# Altium project RELAY 01.PrjPcb
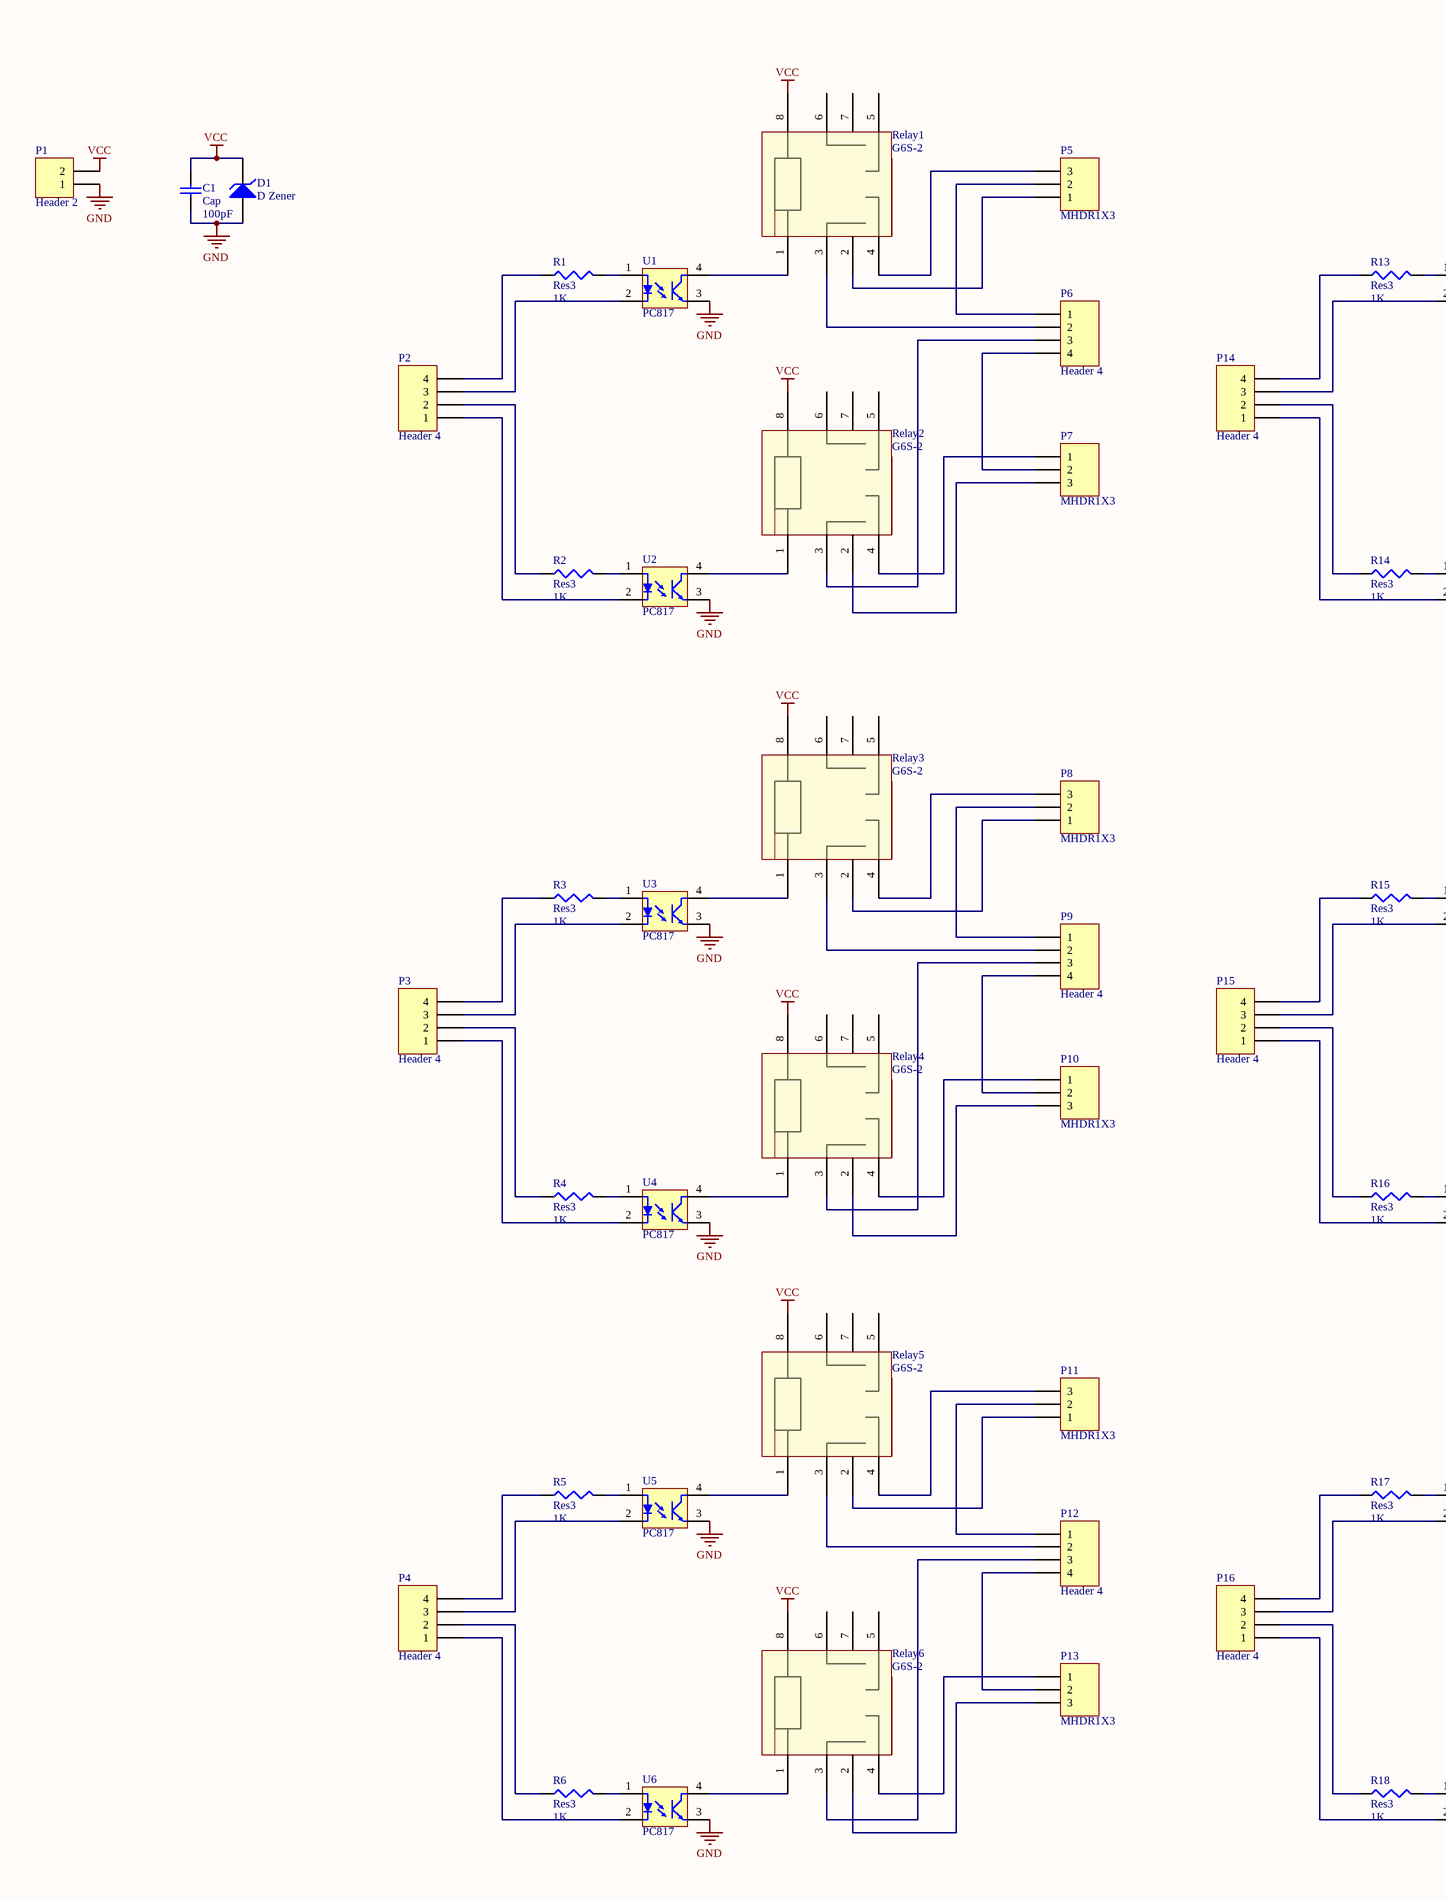
[diagram p0: Relay 01.SchDoc, left]
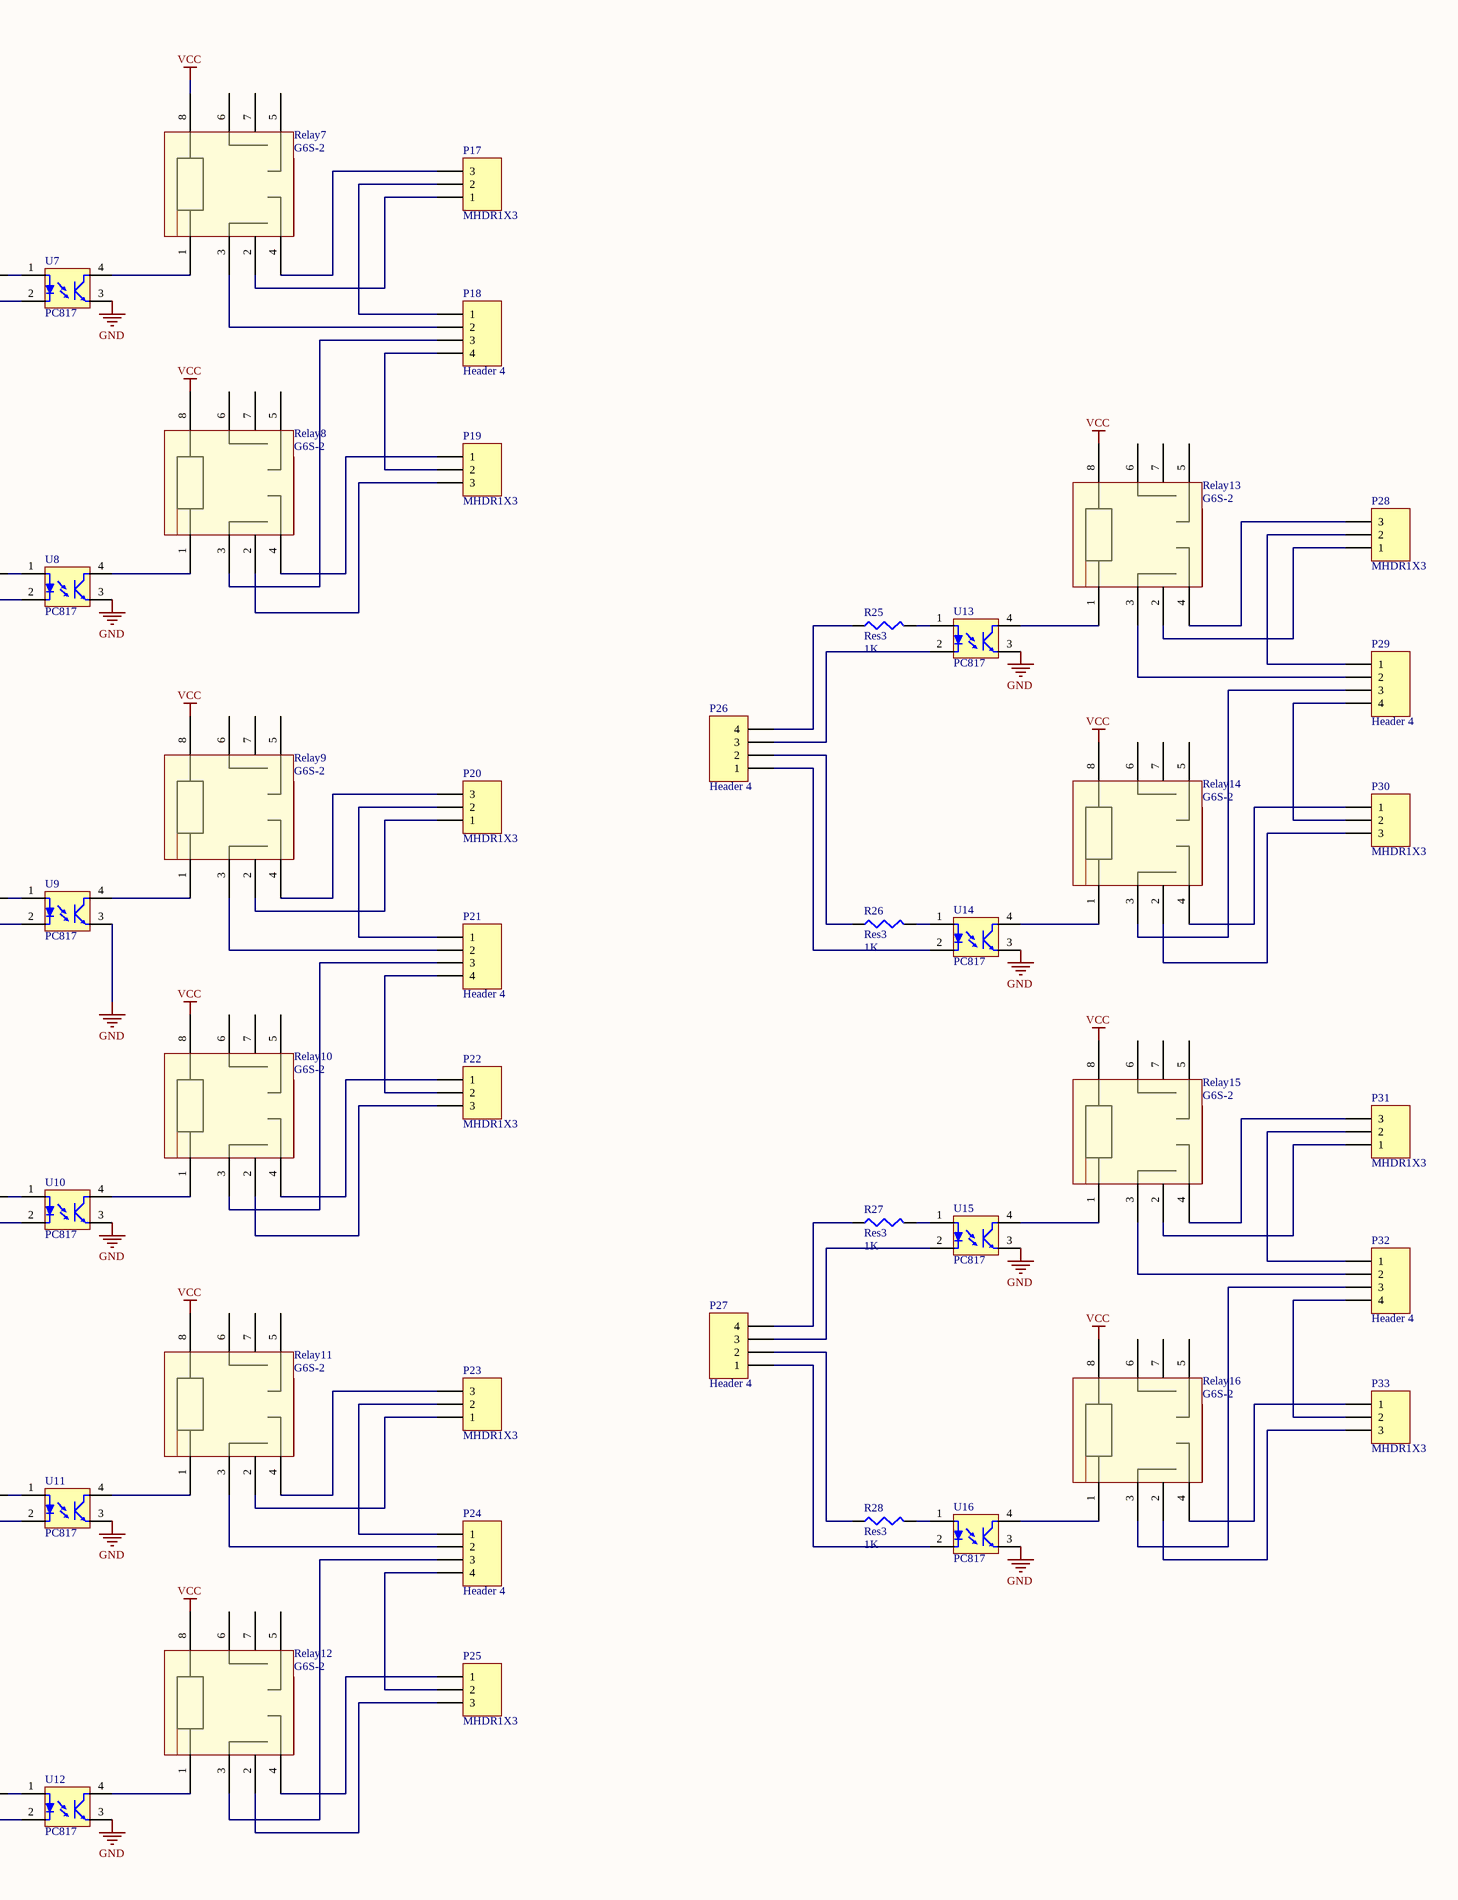
[diagram p1: Relay 01.SchDoc, right]
1 sheet, 83 parts. Net scope: global (net labels, ports and power ports of the same name join across sheets).
Board file: Relay 01.PcbDoc

## Sheet Relay 01.SchDoc
size D

### Parts
C1  Cap  value 100pF  [RAD-0.3]
D1  D Zener  [DIODE-0.7]
P1  Header 2  [CON2]
P2  Header 4  [CON4]
P3  Header 4  [CON4]
P4  Header 4  [CON4]
P5  MHDR1X3  [HDR1X3]
P6  Header 4  [CON4]
P7  MHDR1X3  [HDR1X3]
P8  MHDR1X3  [HDR1X3]
P9  Header 4  [CON4]
P10  MHDR1X3  [HDR1X3]
P11  MHDR1X3  [HDR1X3]
P12  Header 4  [CON4]
P13  MHDR1X3  [HDR1X3]
P14  Header 4  [CON4]
P15  Header 4  [CON4]
P16  Header 4  [CON4]
P17  MHDR1X3  [HDR1X3]
P18  Header 4  [CON4]
P19  MHDR1X3  [HDR1X3]
P20  MHDR1X3  [HDR1X3]
P21  Header 4  [CON4]
P22  MHDR1X3  [HDR1X3]
P23  MHDR1X3  [HDR1X3]
P24  Header 4  [CON4]
P25  MHDR1X3  [HDR1X3]
P26  Header 4  [CON4]
P27  Header 4  [CON4]
P28  MHDR1X3  [HDR1X3]
P29  Header 4  [CON4]
P30  MHDR1X3  [HDR1X3]
P31  MHDR1X3  [HDR1X3]
P32  Header 4  [CON4]
P33  MHDR1X3  [HDR1X3]
R1  Res3  value 1K  [R1/4W]
R2  Res3  value 1K  [R1/4W]
R3  Res3  value 1K  [R1/4W]
R4  Res3  value 1K  [R1/4W]
R5  Res3  value 1K  [R1/4W]
R6  Res3  value 1K  [R1/4W]
R13  Res3  value 1K  [R1/4W]
R14  Res3  value 1K  [R1/4W]
R15  Res3  value 1K  [R1/4W]
R16  Res3  value 1K  [R1/4W]
R17  Res3  value 1K  [R1/4W]
R18  Res3  value 1K  [R1/4W]
R25  Res3  value 1K  [R1/4W]
R26  Res3  value 1K  [R1/4W]
R27  Res3  value 1K  [R1/4W]
R28  Res3  value 1K  [R1/4W]
Relay1  G6S-2  [G6S-2]
Relay2  G6S-2  [G6S-2]
Relay3  G6S-2  [G6S-2]
Relay4  G6S-2  [G6S-2]
Relay5  G6S-2  [G6S-2]
Relay6  G6S-2  [G6S-2]
Relay7  G6S-2  [G6S-2]
Relay8  G6S-2  [G6S-2]
Relay9  G6S-2  [G6S-2]
Relay10  G6S-2  [G6S-2]
Relay11  G6S-2  [G6S-2]
Relay12  G6S-2  [G6S-2]
Relay13  G6S-2  [G6S-2]
Relay14  G6S-2  [G6S-2]
Relay15  G6S-2  [G6S-2]
Relay16  G6S-2  [G6S-2]
U1  value PC817  [DIP4]  (hidden comment: OPTO)
U2  value PC817  [DIP4]  (hidden comment: OPTO)
U3  value PC817  [DIP4]  (hidden comment: OPTO)
U4  value PC817  [DIP4]  (hidden comment: OPTO)
U5  value PC817  [DIP4]  (hidden comment: OPTO)
U6  value PC817  [DIP4]  (hidden comment: OPTO)
U7  value PC817  [DIP4]  (hidden comment: OPTO)
U8  value PC817  [DIP4]  (hidden comment: OPTO)
U9  value PC817  [DIP4]  (hidden comment: OPTO)
U10  value PC817  [DIP4]  (hidden comment: OPTO)
U11  value PC817  [DIP4]  (hidden comment: OPTO)
U12  value PC817  [DIP4]  (hidden comment: OPTO)
U13  value PC817  [DIP4]  (hidden comment: OPTO)
U14  value PC817  [DIP4]  (hidden comment: OPTO)
U15  value PC817  [DIP4]  (hidden comment: OPTO)
U16  value PC817  [DIP4]  (hidden comment: OPTO)

### Nets
GND: C1.1 D1.1(A) P1.1 U1.3(E) U2.3(E) U3.3(E) U4.3(E) U5.3(E) U6.3(E) U7.3(E) U8.3(E) U9.3(E) U10.3(E) U11.3(E) U12.3(E) U13.3(E) U14.3(E) U15.3(E) U16.3(E)
VCC: C1.2 D1.2(K) P1.2 Relay1.8 Relay2.8 Relay3.8 Relay4.8 Relay5.8 Relay6.8 Relay7.8 Relay8.8 Relay9.8 Relay10.8 Relay11.8 Relay12.8 Relay13.8 Relay14.8 Relay15.8 Relay16.8
NetP2_1: P2.1 U2.2(C)
NetP2_2: P2.2 R2.1
NetP2_3: P2.3 U1.2(C)
NetP2_4: P2.4 R1.1
NetP3_1: P3.1 U4.2(C)
NetP3_2: P3.2 R4.1
NetP3_3: P3.3 U3.2(C)
NetP3_4: P3.4 R3.1
NetP4_1: P4.1 U6.2(C)
NetP4_2: P4.2 R6.1
NetP4_3: P4.3 U5.2(C)
NetP4_4: P4.4 R5.1
NetP5_1: P5.1 Relay1.2(NC)
NetP5_2: P5.2 P6.1
NetP5_3: P5.3 Relay1.4(NO)
NetP6_2: P6.2 Relay1.3
NetP6_3: P6.3 Relay2.3
NetP6_4: P6.4 P7.2
NetP7_1: P7.1 Relay2.4(NO)
NetP7_3: P7.3 Relay2.2(NC)
NetP8_1: P8.1 Relay3.2(NC)
NetP8_2: P8.2 P9.1
NetP8_3: P8.3 Relay3.4(NO)
NetP9_2: P9.2 Relay3.3
NetP9_3: P9.3 Relay4.3
NetP9_4: P9.4 P10.2
NetP10_1: P10.1 Relay4.4(NO)
NetP10_3: P10.3 Relay4.2(NC)
NetP11_1: P11.1 Relay5.2(NC)
NetP11_2: P11.2 P12.1
NetP11_3: P11.3 Relay5.4(NO)
NetP12_2: P12.2 Relay5.3
NetP12_3: P12.3 Relay6.3
NetP12_4: P12.4 P13.2
NetP13_1: P13.1 Relay6.4(NO)
NetP13_3: P13.3 Relay6.2(NC)
NetP14_1: P14.1 U8.2(C)
NetP14_2: P14.2 R14.1
NetP14_3: P14.3 U7.2(C)
NetP14_4: P14.4 R13.1
NetP15_1: P15.1 U10.2(C)
NetP15_2: P15.2 R16.1
NetP15_3: P15.3 U9.2(C)
NetP15_4: P15.4 R15.1
NetP16_1: P16.1 U12.2(C)
NetP16_2: P16.2 R18.1
NetP16_3: P16.3 U11.2(C)
NetP16_4: P16.4 R17.1
NetP17_1: P17.1 Relay7.2(NC)
NetP17_2: P17.2 P18.1
NetP17_3: P17.3 Relay7.4(NO)
NetP18_2: P18.2 Relay7.3
NetP18_3: P18.3 Relay8.3
NetP18_4: P18.4 P19.2
NetP19_1: P19.1 Relay8.4(NO)
NetP19_3: P19.3 Relay8.2(NC)
NetP20_1: P20.1 Relay9.2(NC)
NetP20_2: P20.2 P21.1
NetP20_3: P20.3 Relay9.4(NO)
NetP21_2: P21.2 Relay9.3
NetP21_3: P21.3 Relay10.3
NetP21_4: P21.4 P22.2
NetP22_1: P22.1 Relay10.4(NO)
NetP22_3: P22.3 Relay10.2(NC)
NetP23_1: P23.1 Relay11.2(NC)
NetP23_2: P23.2 P24.1
NetP23_3: P23.3 Relay11.4(NO)
NetP24_2: P24.2 Relay11.3
NetP24_3: P24.3 Relay12.3
NetP24_4: P24.4 P25.2
NetP25_1: P25.1 Relay12.4(NO)
NetP25_3: P25.3 Relay12.2(NC)
NetP26_1: P26.1 U14.2(C)
NetP26_2: P26.2 R26.1
NetP26_3: P26.3 U13.2(C)
NetP26_4: P26.4 R25.1
NetP27_1: P27.1 U16.2(C)
NetP27_2: P27.2 R28.1
NetP27_3: P27.3 U15.2(C)
NetP27_4: P27.4 R27.1
NetP28_1: P28.1 Relay13.2(NC)
NetP28_2: P28.2 P29.1
NetP28_3: P28.3 Relay13.4(NO)
NetP29_2: P29.2 Relay13.3
NetP29_3: P29.3 Relay14.3
NetP29_4: P29.4 P30.2
NetP30_1: P30.1 Relay14.4(NO)
NetP30_3: P30.3 Relay14.2(NC)
NetP31_1: P31.1 Relay15.2(NC)
NetP31_2: P31.2 P32.1
NetP31_3: P31.3 Relay15.4(NO)
NetP32_2: P32.2 Relay15.3
NetP32_3: P32.3 Relay16.3
NetP32_4: P32.4 P33.2
NetP33_1: P33.1 Relay16.4(NO)
NetP33_3: P33.3 Relay16.2(NC)
NetR1_2: R1.2 U1.1(A)
NetR2_2: R2.2 U2.1(A)
NetR3_2: R3.2 U3.1(A)
NetR4_2: R4.2 U4.1(A)
NetR5_2: R5.2 U5.1(A)
NetR6_2: R6.2 U6.1(A)
NetR13_2: R13.2 U7.1(A)
NetR14_2: R14.2 U8.1(A)
NetR15_2: R15.2 U9.1(A)
NetR16_2: R16.2 U10.1(A)
NetR17_2: R17.2 U11.1(A)
NetR18_2: R18.2 U12.1(A)
NetR25_2: R25.2 U13.1(A)
NetR26_2: R26.2 U14.1(A)
NetR27_2: R27.2 U15.1(A)
NetR28_2: R28.2 U16.1(A)
NetRelay1_1: Relay1.1 U1.4(C)
NetRelay2_1: Relay2.1 U2.4(C)
NetRelay3_1: Relay3.1 U3.4(C)
NetRelay4_1: Relay4.1 U4.4(C)
NetRelay5_1: Relay5.1 U5.4(C)
NetRelay6_1: Relay6.1 U6.4(C)
NetRelay7_1: Relay7.1 U7.4(C)
NetRelay8_1: Relay8.1 U8.4(C)
NetRelay9_1: Relay9.1 U9.4(C)
NetRelay10_1: Relay10.1 U10.4(C)
NetRelay11_1: Relay11.1 U11.4(C)
NetRelay12_1: Relay12.1 U12.4(C)
NetRelay13_1: Relay13.1 U13.4(C)
NetRelay14_1: Relay14.1 U14.4(C)
NetRelay15_1: Relay15.1 U15.4(C)
NetRelay16_1: Relay16.1 U16.4(C)

Not connected (* = marked no-connect by the designer): Relay1 5 6 7; Relay2 5 6 7; Relay3 5 6 7; Relay4 5 6 7; Relay5 5 6 7; Relay6 5 6 7; Relay7 5 6 7; Relay8 5 6 7; Relay9 5 6 7; Relay10 5 6 7; Relay11 5 6 7; Relay12 5 6 7; Relay13 5 6 7; Relay14 5 6 7; Relay15 5 6 7; Relay16 5 6 7

### Library data of the parts
C1 = Cap: Capacitor; Published: 8-Jun-2000; LatestRevisionDate: 17-Jul-2002; LatestRevisionNote: Re-released for DXP Platform.; PackageReference: RAD-0.3; Publisher: Altium Limited; PackageDescription: Radial Cap, Thru-Hole; 2 Leads; 0.3 in Pin Spacing
D1 = D Zener: Zener Diode; Published: 8-Jun-2000; LatestRevisionDate: 17-Jul-2002; LatestRevisionNote: Re-released for DXP Platform.; PackageReference: DIODE-0.7; Publisher: Altium Limited; PackageDescription: Diode, Thru-Hole; 2 Leads; 0.7 in Pin Spacing
P1 = Header 2: Header, 2-Pin; LatestRevisionDate: 17-Jul-2002; LatestRevisionNote: Re-released for DXP Platform.; Publisher: Altium Limited
P2-P4 P6 P9 P12 P14-P16 P18 P21 P24 P26 P27 P29 P32 = Header 4: Header, 4-Pin; LatestRevisionDate: 17-Jul-2002; LatestRevisionNote: Re-released for DXP Platform.; Publisher: Altium Limited
P5 P7 P8 P10 P11 P13 P17 P19 P20 P22 P23 P25 P28 P30 P31 P33 = MHDR1X3: Header, 3-Pin; LatestRevisionDate: 17-Jul-2002; LatestRevisionNote: Re-released for DXP Platform.; Publisher: Altium Limited
R1-R6 R13-R18 R25-R28 = Res3: Resistor; Published: 8-Jun-2000; LatestRevisionDate: 29-May-2009; LatestRevisionNote: IPC-7351 Footprint Added.; PackageReference: J1-0603; Publisher: Altium Limited; PackageDescription: Chip Resistor
U1-U16 = OPTO_PC817